# Altium schematic sheet OBD2.SchDoc
size A4; SheetNumber: 6; SheetTotal: 8
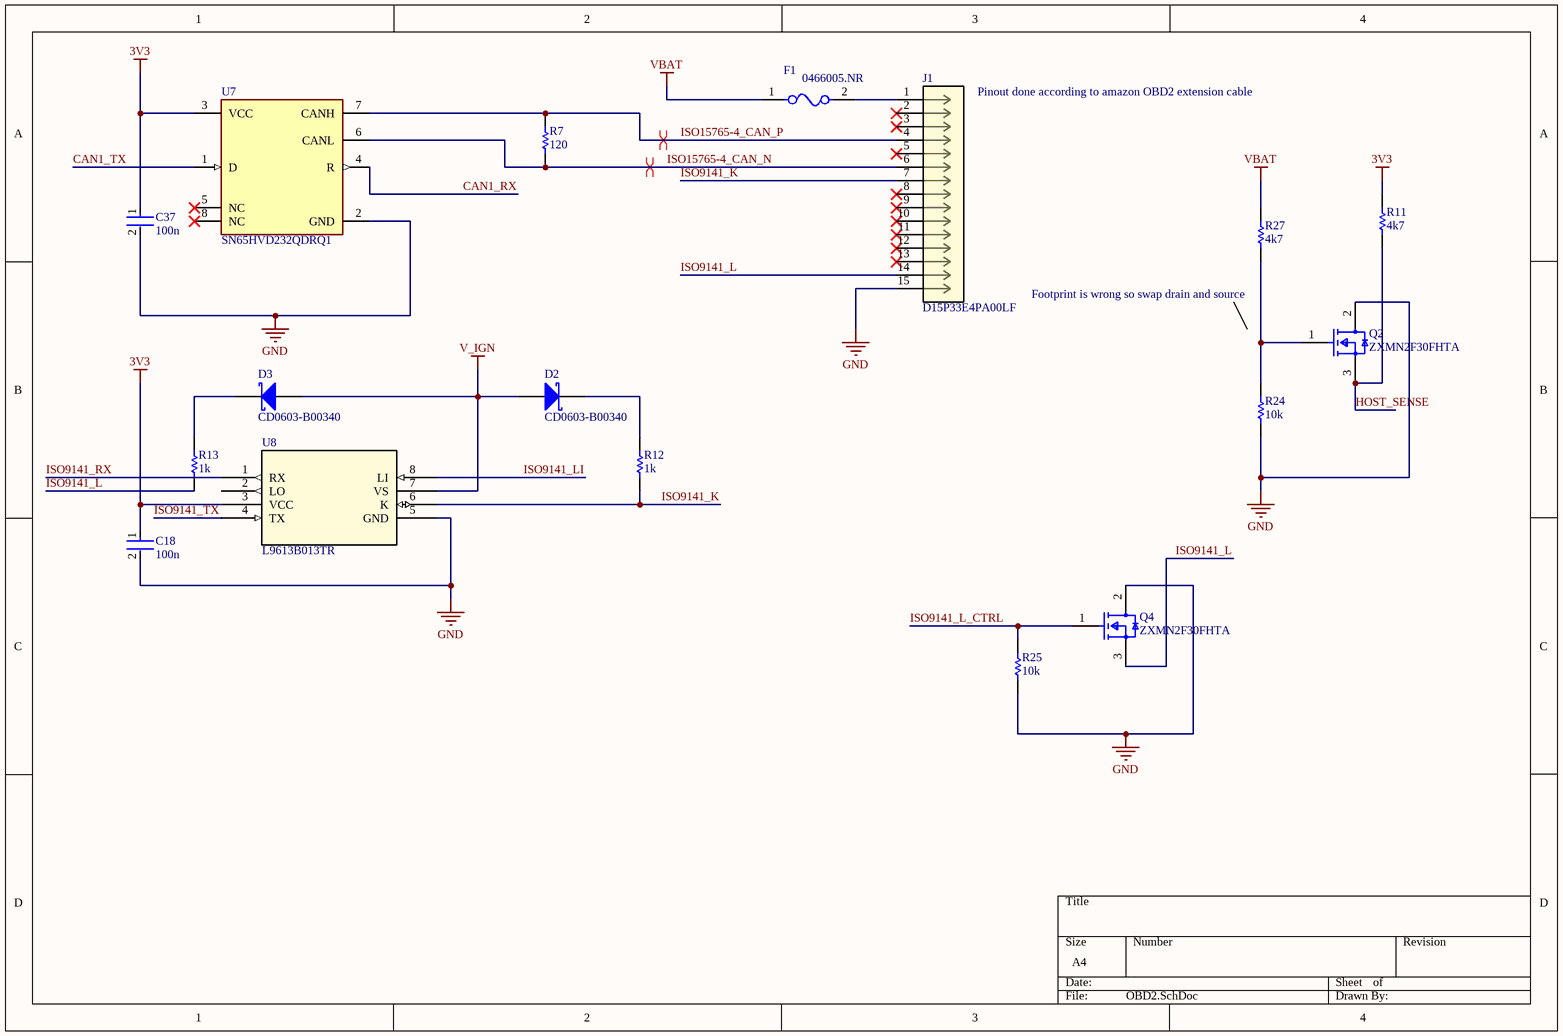
[diagram p0: OBD2.SchDoc]

## Parts
C18  100n  [FP-GRM188-0_1-e0_2_0_55-IPC_A]
C37  100n  [FP-GRM188-0_1-e0_2_0_55-IPC_A]
D2  CD0603-B00340  [BOUR-0603_V]
D3  CD0603-B00340  [BOUR-0603_V]
F1  0466005.NR  [FP-0466-MFG]
J1  D15P33E4PA00LF  [CONN9_LD15P_1556x500_AMP]
Q2  ZXMN2F30FHTA  [FP-SOT23-IPC_C]
Q4  ZXMN2F30FHTA  [FP-SOT23-IPC_C]
R7  120  [RESC1608X55X30ML15T15]
R11  4k7  [RESC1608X55X30ML15T15]
R12  1k  [RESC1608X55X30ML15T15]
R13  1k  [RESC1608X55X30ML15T15]
R24  10k  [RESC1608X55X30ML15T15]
R25  10k  [RESC1608X55X30ML15T15]
R27  4k7  [RESC1608X55X30ML15T15]
U7  SN65HVD232QDRQ1  [FP-D0008A-MFG]
U8  L9613B013TR  [L9613B013TR_STM]

## Nets
3V3: C18.1 C37.1 R11.2 U7.3(VCC) U8.3(VCC)
GND: C18.2 C37.2 J1.15 Q2.2(S) Q4.2(S) R24.1 R25.1 U7.2(GND) U8.5(GND)
V_IGN: D2.1(A) D3.1(A) U8.7(VS)
VBAT: F1.1 R27.2
CAN1_RX: U7.4(R)
CAN1_TX: U7.1(D)
HOST_SENSE: Q2.3(D) R11.1
ISO9141_K: J1.7 R12.1 U8.6(K)
ISO9141_L: J1.14 Q4.3(D) R13.1
ISO9141_L_CTRL: Q4.1(G) R25.2
ISO9141_LI: U8.8(LI)
ISO9141_RX: U8.1(RX)
ISO9141_TX: U8.4(TX)
ISO15765-4_CAN_N: J1.6 R7.1 U7.6(CANL)
ISO15765-4_CAN_P: J1.4 R7.2 U7.7(CANH)
NetD2_2: D2.2(K) R12.2
NetD3_2: D3.2(K) R13.2
NetF1_2: F1.2 J1.1
NetQ2_1: Q2.1(G) R24.2 R27.1

Not connected (* = marked no-connect by the designer): J1 2* 3* 5* 8* 9* 10* 11* 12* 13*; U7 5(NC)* 8(NC)*; U8 2(LO)

## Layout directives
differential pair: ISO15765-4_CAN_N, ISO15765-4_CAN_P

## Notes on the sheet
- Pinout done according to amazon OBD2 extension cable
- Footprint is wrong so swap drain and source

## Library data of the parts
C18 C37 = CMP-2006-02792-2: Chip Multilayer Ceramic Capacitors for General Purpose, 0603, 10uF, X5R, 15%, 20%, 6.3V; Packaging: Tape and Reel; Voltage Rating (DC): 6.3V; Width: 0.031inch; Termination: SMD/SMT; Dielectric: X5R; Package Quantity: 4000; Voltage Rating: 6.3V; Capacitance: 10uF; Case/Package: 0603; Min Operating Temperature: -55°C; Voltage: 6.3V; Length: 1.6mm; Thickness: 0.035inch; Lead Free: Lead Free; Depth: 0.8mm; Case Code (Imperial): 0603; Max Operating Temperature: 85°C; Material: Ceramic; Height: 0.8mm; Tolerance: 20%; Mount: Surface Mount; REACH SVHC: No SVHC; Radiation Hardening: No; Case Code (Metric): 1608
D2 D3 = CMP-2000-06081-1: Schottky Barrier Chip Diode Serie, 30 mA, 370 mV, -40 to 125 degC, 2-Pin SMD (0603), RoHS, Tape and Reel; Manufacturer: Bourns; COO: TW; Peak Forward Voltage: 0.37@0.001AV; Peak Non-Repetitive Surge Current: 0.5A; Pin_Count: 2; Peak Reverse Current: 1@40VuA; Peak Reverse Repetitive Voltage: 45V; Configuration: Single; Maximum Continuous Forward Current: 0.03A; Type: SmallSignalSchottkyDiode; Package Description: 2-Pin Surface Mount Device, Body 1.7 x 0.9 mm; RoHS: Yes; Dimension: 1.8(Max)x1(Max)mm; Package Reference: 0603; Mounting: SurfaceMount; Peak Reverse Recovery Time: N/A; Supplier: Bourns; HTS: 8541100070; ECCN: EAR99; Datasheet Version: 10/2009; Mounting Technology: SurfaceMount; Supplier_Package: Case0603; Packaging: TapeandReel; Family: CD0603B00340; Part No: CD0603-B00340; Manufacturer URL: http://www.bourns.com/; Datasheet URL: https://datasheet.ciiva.com/5831/714183-5831824.pdf; Operating Temperature: -40to125C
F1 = CMP-08605-000032-1: FUSE BOARD MNT 5A 32VAC/VDC 1206; Manufacturer: Littelfuse Inc; Value: 0.011Ω; Max Fuse Ac Voltage: 32V; Fuse I2T: 2.5A2Sec; Fuse Interrupt Ac Current: 50A; Fuse Blow Speed: Fast; Fuse Voltage Drop: 73.75mV; Category: Fuse; Temperature: -55°C to +90°C; Lead Free: Yes; Temperature Range High: +90°C; RoHS: TRUE; Device Class L2: Fuses; ComponentLink2URL: https://www.littelfuse.com/~/media/electronics/datasheets/fuses/littelfuse_fuse_466_datasheet.pdf.pdf; Fuse Current: 5A; Octopart: https://octopart.com/0466005.nr-littelfuse-143206; Automotive: No; Max Fuse Dc Voltage: 32V; Temperature Range Low: -55°C; Device Class L3: unset; ComponentLink2Description: Datasheet; Manufacturer Part Number: 0466005.NR; Fuse Interrupt Dc Current: 50A; Resistance: 0.011Ω; Package: 0466; Device Class L1: Circuit Protection; Mouser Description: Surface Mount Fuses 32V 5A VFA Slimline; Height: 0.66mm; Voltage Rating: 32V; Digikey Description: FUSE BOARD MNT 5A 32VAC/VDC 1206
J1 = D15P33E4PA00LF: No Description Available; Mfr_Name: Amphenol ICC; RefDes: RefDes; Type: Type
Q2 Q4 = CMP-12801-000082-1: MOSFET N-CH 20V 4.1A SOT23-3; Nominal Vgs: 900mV; Number of Elements: 1; Power Dissipation: 1.4W; On-State Resistance: 45mR; Rise Time: 5.6ns; Gate to Source Voltage (Vgs): 12V; Turn-Off Delay Time: 19.4ns; Turn-On Delay Time: 2.9ns; Max Power Dissipation: 960mW; Element Configuration: Single; Continuous Drain Current (ID): 4.9A; Input Capacitance: 452pF; Case/Package: SOT-23; Lead Free: Lead Free; Weight: 0.000282oz; Min Operating Temperature: -55°C; Mount: Surface Mount; Width: 1.4mm; Drain to Source Voltage (Vdss): 20V; Dual Supply Voltage: 20V; Length: 3.04mm; Threshold Voltage: 900mV; Package Quantity: 3000; Number of Pins: 3; Height: 1.02mm; Drain to Source Resistance: 45mR; Rds On Max: 45mR; Max Operating Temperature: 150°C; Fall Time: 5.6ns; Packaging: Tape and Reel; Termination: SMD/SMT; Drain to Source Breakdown Voltage: 20V; REACH SVHC: No SVHC; Radiation Hardening: No; Number of Channels: 1
R7 R11-R13 R24 R25 R27 = CMP-2000-00182-1: Part Number: ERJ-3EKF1003V; Manufacturer: Panasonic
U7 = CMP-04872-000052-1: IC TRANSCEIVER HALF 1/1 8SOIC; Max Supply Current: 17mA; Data Rate: 1Mbps; Number of Receive Buffers: 1; Max Supply Voltage: 3.6V; Operating Supply Voltage: 3.3V; Interface: CAN; Min Supply Voltage: 3V; Contact Plating: Gold; Case/Package: SOIC; Mount: Surface Mount; Number of Transceivers: 1; Number of Drivers: 1; Package Quantity: 2500; Number of Pins: 8; REACH SVHC: No SVHC; RoHS Compliant: Yes; Series: -; Supply Current: 17mA; Radiation Hardening: No; Nominal Supply Current: 17mA; Lead Free: Lead Free; Number of Transmit Buffers: 1; Max Operating Temperature: 125°C; Packaging: Tape and Reel; Weight: 0.002822oz; Min Operating Temperature: -40°C
U8 = L9613B013TR: No Description Available; Mfr_Name: STMicroelectronics; RefDes: RefDes; Type: Type